# Altium project MICROHAL TESTER SPI LOOPBACK ver B.PrjPcb
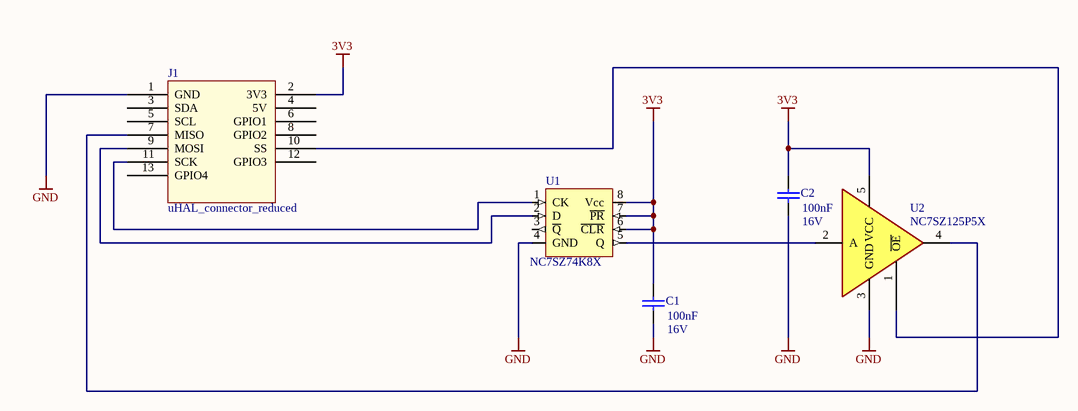
[diagram p0: spi_loopback_b.SchDoc]
1 sheet, 5 parts. Net scope: global (net labels, ports and power ports of the same name join across sheets).

## Sheet spi_loopback_b.SchDoc
size A4

### Parts
C1  Capacitance: 100nF  Voltage Rating (DC): 16V  [CAPC1608X90X35NL15T15]  (hidden comment: Kemet C0603C104K4RAC7013)
C2  Capacitance: 100nF  Voltage Rating (DC): 16V  [CAPC1608X90X35NL15T15]  (hidden comment: Kemet C0603C104K4RAC7013)
J1  uHAL_connector_reduced  [PCB-45ncoppm4oopozvqifsq-1]
U1  Manufacturer Part Number: NC7SZ74K8X  [SOP8]  (hidden comment: ON Semiconductor NC7SZ74K8X)
U2  NC7SZ125P5X  [SOT23127P600-8N]

### Nets
3V3: C1.2 C2.2 J1.2(3V3) U1.6(~{CLR}) U1.7(~{PR}) U1.8(Vcc) U2.5(VCC)
GND: C1.1 C2.1 J1.1(GND) U1.4(GND) U2.3(GND)
NetJ1_7: J1.7(MISO) U2.4(Y)
NetJ1_9: J1.9(MOSI) U1.2(D)
NetJ1_10: J1.10(SS) U2.1(~{OE})
NetJ1_11: J1.11(SCK) U1.1(CK)
NetU1_5: U1.5(Q) U2.2(A)

Not connected (* = marked no-connect by the designer): J1 3(SDA) 4(5V) 5(SCL) 6(GPIO1) 8(GPIO2) 12(GPIO3) 13(GPIO4); U1 3(~{Q})

### Library data of the parts
C1 C2 = CMP-4113029-2: CAP CER 0.1UF 16V 10% X7R 0603; Dielectric Material: Ceramic; Lead-Free Status: R; Capacitance Tolerance: ±10%; Case/Package: 0603; Dielectric Characteristic: X7R; Mounting Style: Surface Mount; Octopart Url: https://octopart.com/c0603c104k4rac7013-kemet-1636679; OctopartID: 5e2b9739820a81ec; RoHS: Compliant
J1 = CMP-2q23h2cwhjlfm8s6r7i8-1: connector for uHAL with reduced pin number; CustomComponentID: 2q23h2cwhjlfm8s6r7i8
U1 = CMP-a3886f844fd47c4f-2: NC7SZ74 Series 5.5 V TinyLogic UHS D-Type Flip-Flop with Preset and Clear - US8; Supply Voltage (DC): 5.50 V (max), 1.65 V (min); Frequency: 200 MHz; Number of Bits: 1; Polarity: Non-Inverting, Inverting; Lead-Free Status: Lead Free; Output Current: 32.0 mA; OctopartID: a3886f844fd47c4f; Number of Pins: 8; Octopart URL: https://octopart.com/nc7sz74k8x-on+semiconductor-84330810; Operating Temperature: -40.0 °C to 85.0 °C; REACH SVHC Compliance: No SVHC; RoHS: Compliant; Mounting Style: Surface Mount; Packaging: Tape & Reel (TR), Cut Tape (CT); Lifecycle Status: Active
U2 = CMP-f54f3c43aefd2a88-2: NC7SZ125 Series 5.5 V TinyLogic® UHS Single Buffer w/ 3-State Output - SC-70-5; Number of Bits: 1; Supply Voltage (DC): 5.00 V, 5.50 V (max); Lifecycle Status: Active; Number of Pins: 5; OctopartID: f54f3c43aefd2a88; Octopart URL: http://octopart.com/nc7sz125p5x-fairchild+semiconductor-425684; REACH SVHC Compliance: No SVHC; RoHS: Compliant; Mounting Style: Surface Mount; Number of Circuits: 1; Packaging: Cut Tape (CT), Tape & Reel (TR); Manufacturer Part Number: NC7SZ125P5X